# Altium schematic sheet Motor Controllers.SchDoc
size B; DocumentNumber: 3; SheetNumber: 3; SheetTotal: 4
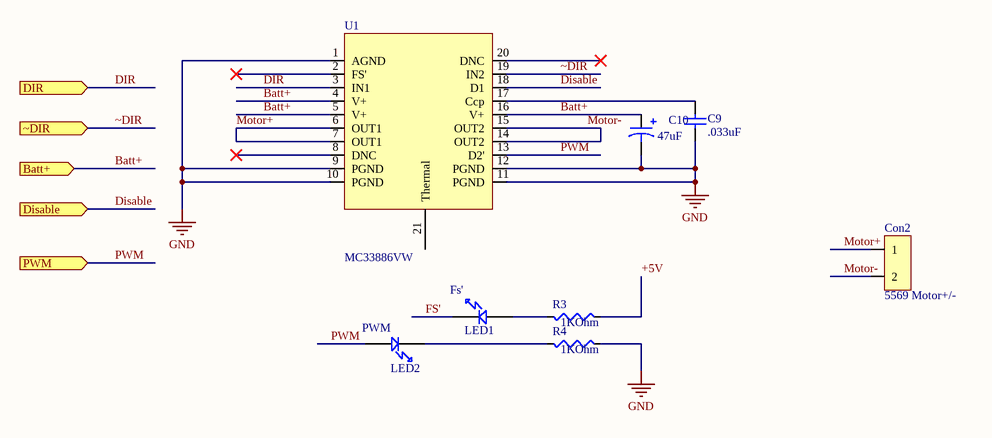
[diagram p0: Motor Controllers.SchDoc]

## Parts
C9  .033uF  [0805 (2012) Capacitor]
C10  47uF  [Radial_6.3mmDia_SM_D]
Con2  5569 Motor+/-  [5569 Mini-Fit Jr 2-Pos Right Angle w/ PCB Mounting Flange]
LED1  Fs'  [LED 0805]
LED2  PWM  [LED 0805]
R3  1KOhm  [R 0805 (2012) RESISTOR]
R4  1KOhm  [R 0805 (2012) RESISTOR]
U1  MC33886VW  [SOP127P1420X340_HS-20N]

## Ports
Batt+ (in), DIR (in), Disable (in), PWM (in), ~DIR (in)

## Nets
GND: C9.1 C10.N R4.2 U1.1(AGND) U1.9(PGND) U1.10(PGND) U1.11(PGND) U1.12(PGND)
+5V: R3.2
Batt+: C10.P U1.4(V+) U1.5(V+) U1.16(V+) ; port Batt+
DIR: U1.3(IN1) ; port DIR
Disable: U1.18(D1) ; port Disable
FS': LED1.1
Motor+: Con2.1 U1.6(OUT1) U1.7(OUT1)
Motor-: Con2.2 U1.14(OUT2) U1.15(OUT2)
PWM: LED2.2 U1.13(D2') ; port PWM
~DIR: U1.19(IN2) ; port ~DIR
NetC9_2: C9.2 U1.17(Ccp)
NetLED1_2: LED1.2 R3.1
NetLED2_1: LED2.1 R4.1

Not connected (* = marked no-connect by the designer): U1 2(FS')* 8(DNC)* 20(DNC)* 21(Thermal)

## Library data of the parts
C9 = Capacitor (non-polarized): Capacitor; Value: .1uF
C10 = Capacitor (polarized)
Con2 = 5569 Mini-Fit Jr 2-Pos Right Angle
LED1 LED2 = LED: Standard LED
R3 R4 = Resistor: Value: 0Ohm
U1 = MC33886VW: Motor Controller